# Altium schematic sheet lab1_sokolov_usb_i2c.SchDoc: =title_line_1 + title_line_2
size 594 x 420 mm; SheetNumber: n
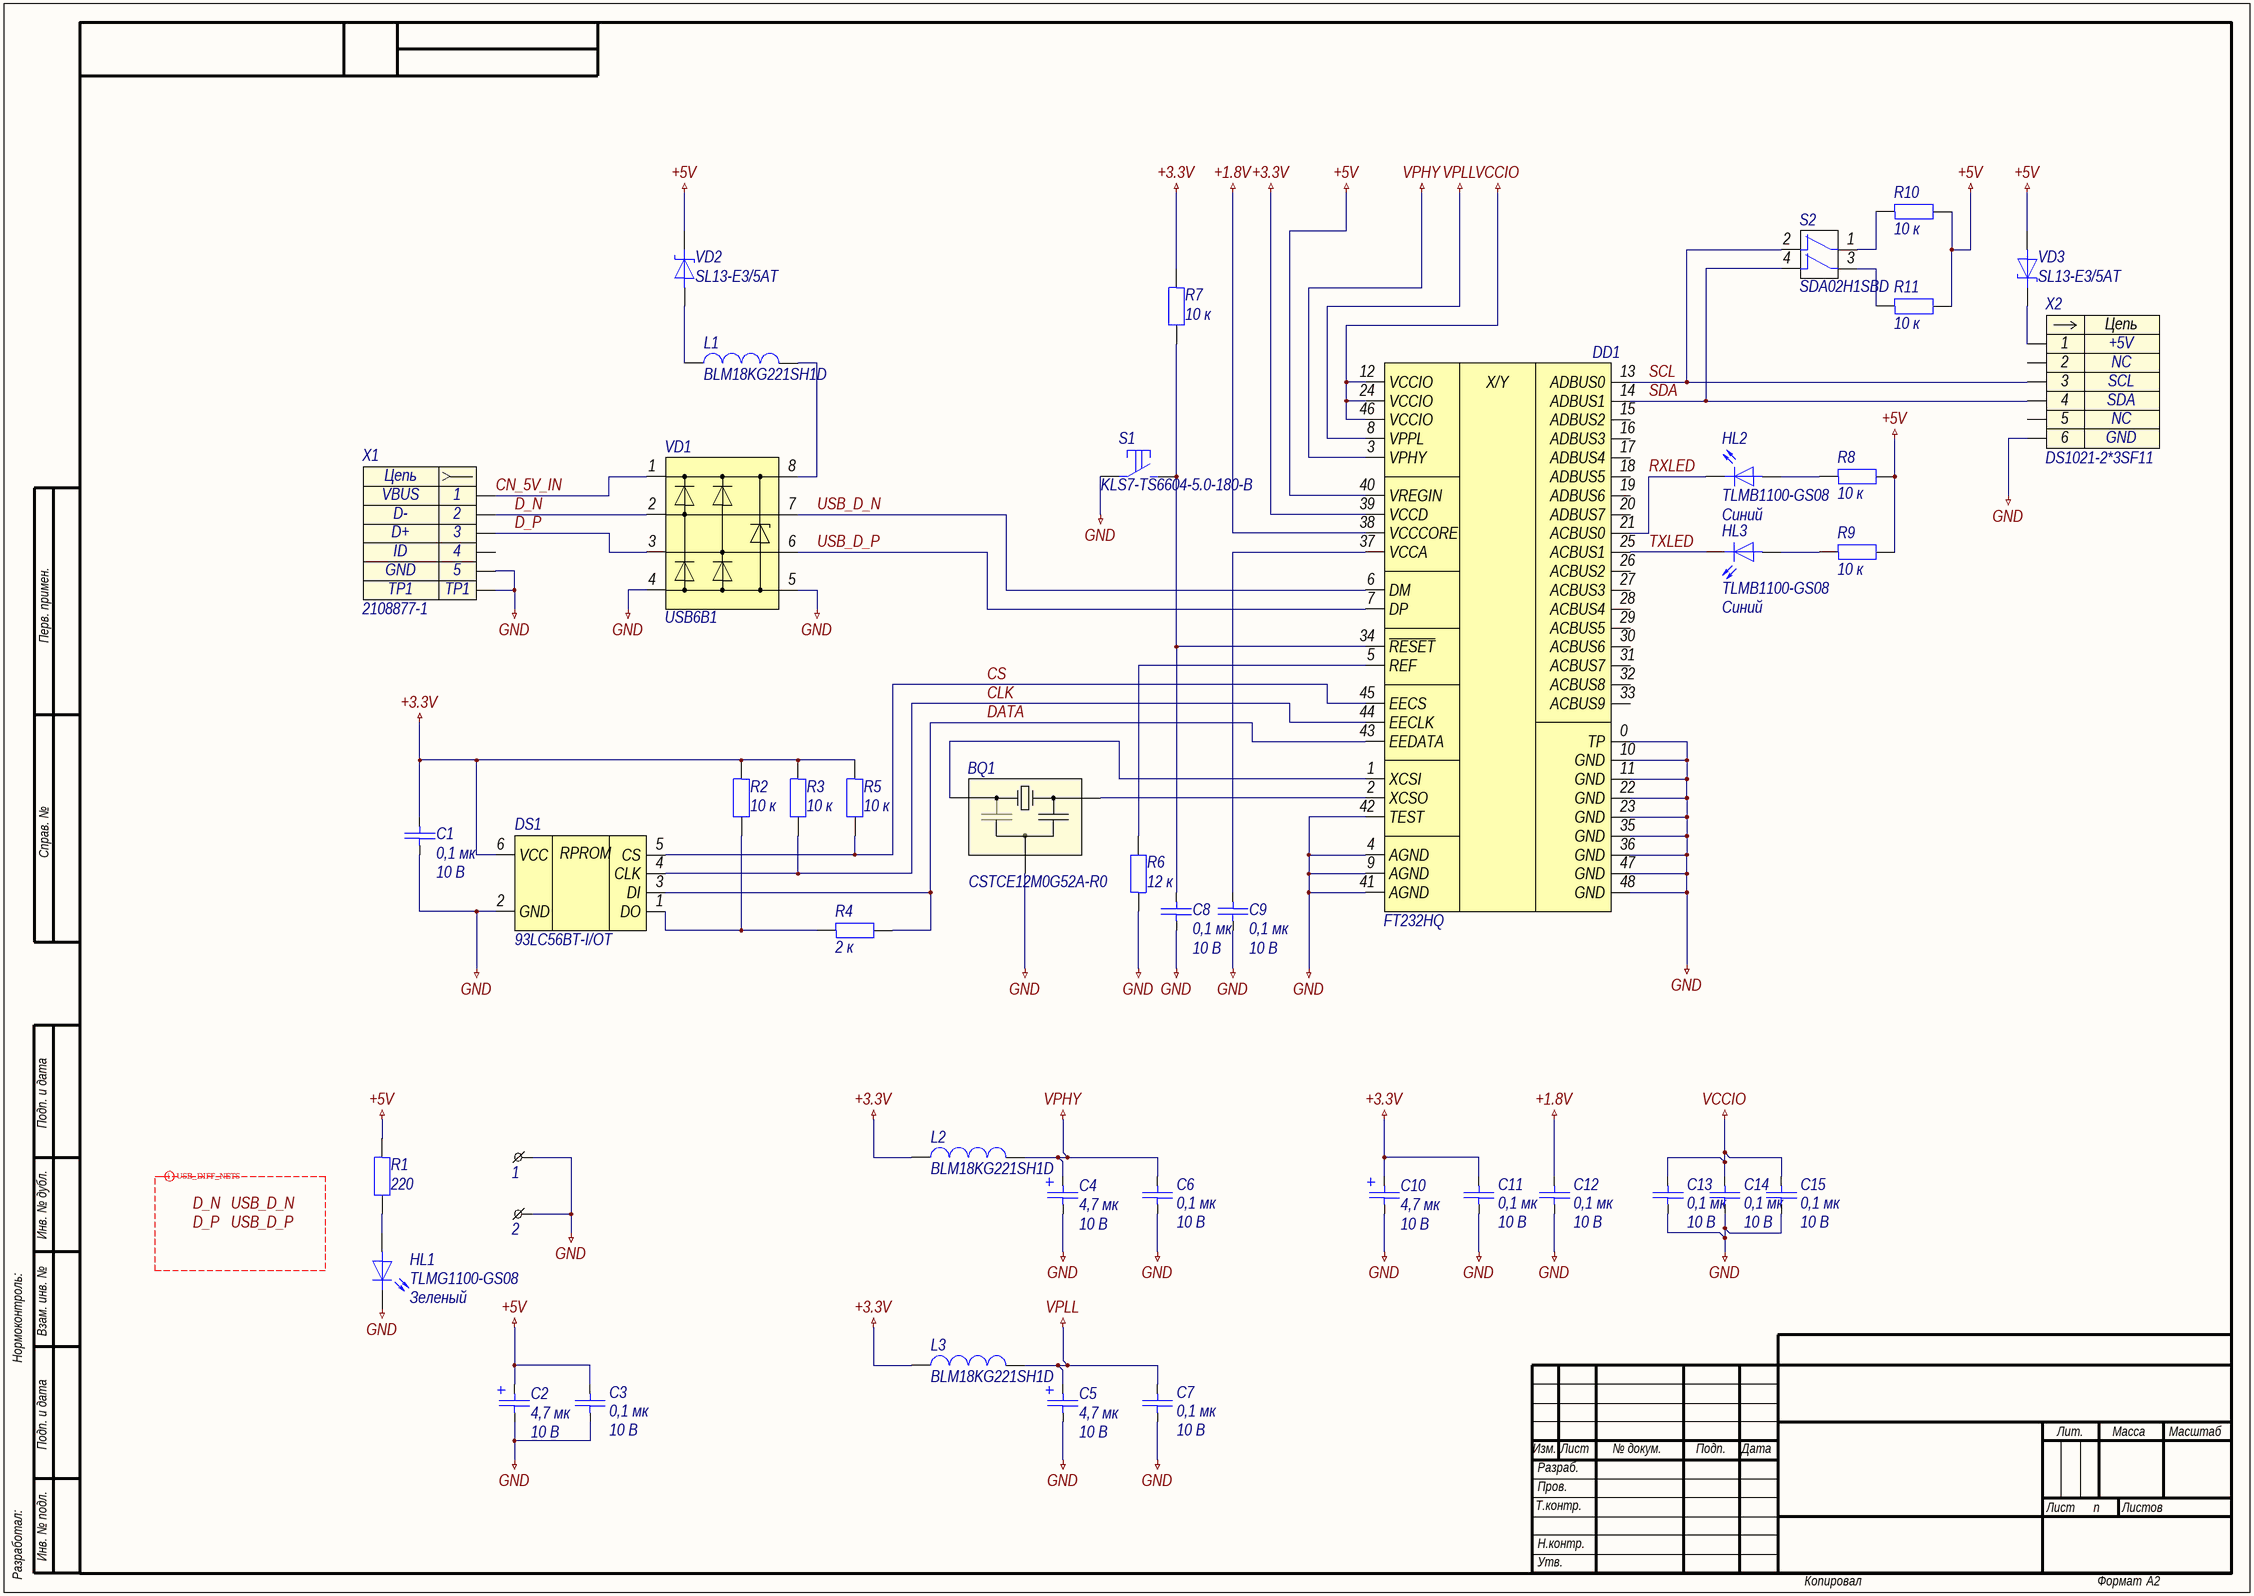
[diagram p0: lab1_sokolov_usb_i2c.SchDoc]

## Parts
1  MOUNTING_HOLE  [HOLE_1,6X3,3]  (value not drawn)
2  MOUNTING_HOLE  [HOLE_1,6X3,3]  (value not drawn)
BQ1  CSTCE12M0G52A-R0  [CSTCE-3-320X130X70]
C1  0,1 мк  Напряжение: 10 В  [C0603]
C2  4,7 мк  Напряжение: 10 В  [C3216-18]
C3  0,1 мк  Напряжение: 10 В  [C0603]
C4  4,7 мк  Напряжение: 10 В  [C3216-18]
C5  4,7 мк  Напряжение: 10 В  [C3216-18]
C6  0,1 мк  Напряжение: 10 В  [C0603]
C7  0,1 мк  Напряжение: 10 В  [C0603]
C8  0,1 мк  Напряжение: 10 В  [C0603]
C9  0,1 мк  Напряжение: 10 В  [C0603]
C10  4,7 мк  Напряжение: 10 В  [C3216-18]
C11  0,1 мк  Напряжение: 10 В  [C0603]
C12  0,1 мк  Напряжение: 10 В  [C0603]
C13  0,1 мк  Напряжение: 10 В  [C0603]
C14  0,1 мк  Напряжение: 10 В  [C0603]
C15  0,1 мк  Напряжение: 10 В  [C0603]
DD1  FT232HQ  [QFN-48-800X800X90]
DS1  93LC56BT-I/OT  [SOT-23-6]
HL1  TLMG1100-GS08  Colour: Зеленый  [HL0603]
HL2  TLMB1100-GS08  Colour: Синий  [HL0603]
HL3  TLMB1100-GS08  Colour: Синий  [HL0603]
L1  BLM18KG221SH1D  [BLM-2-0603]
L2  BLM18KG221SH1D  [BLM-2-0603]
L3  BLM18KG221SH1D  [BLM-2-0603]
R1  220  [R0603]
R2  10 к  [R0603]
R3  10 к  [R0603]
R4  2 к  [R0603]
R5  10 к  [R0603]
R6  12 к  [R0603]
R7  10 к  [R0603]
R8  10 к  [R0603]
R9  10 к  [R0603]
R10  10 к  [R0603]
R11  10 к  [R0603]
S1  KLS7-TS6604-5.0-180-B  [KLS7-TS6604-5.0-180-B]
S2  SDA02H1SBD  [SDA02H1SBD]
VD1  USB6B1  [SO-8]
VD2  SL13-E3/5AT  [DO-214AC]
VD3  SL13-E3/5AT  [DO-214AC]
X1  2108877-1  [2108877-1]
X2  DS1021-2*3SF11  [DS1021-2X3SF11]

## Nets
+1.8V: C12.1 DD1.38(VCCCORE)
+3.3V: C1.1 C10.1 C11.1 DD1.39(VCCD) DS1.6(VCC) L2.1 L3.1 R2.1 R3.1 R5.1 R7.1
+5V: C2.1 C3.1 DD1.40(VREGIN) R1.1 R8.2 R9.2 R10.2 R11.2 VD2.1 VD3.2
GND: 1.1 2.1 BQ1.2 C1.2 C2.2 C3.2 C4.2 C5.2 C6.2 C7.2 C8.2 C9.1 C10.2 C11.2 C12.2 C13.2 C14.2 C15.2 DD1.0(TP) DD1.4(AGND) DD1.9(AGND) DD1.10(GND) DD1.11(GND) DD1.22(GND) DD1.23(GND) DD1.35(GND) DD1.36(GND) DD1.41(AGND) DD1.42(TEST) DD1.47(GND) DD1.48(GND) DS1.2(GND) HL1.1 R6.1 S1.1 VD1.4 VD1.5 X1.5 X1.TP1 X2.6
VCCIO: C13.1 C14.1 C15.1 DD1.12(VCCIO) DD1.24(VCCIO) DD1.46(VCCIO)
VPHY: C4.1 C6.1 DD1.3(VPHY) L2.2
VPLL: C5.1 C7.1 DD1.8(VPPL) L3.2
CLK: DD1.44(EECLK) DS1.4(CLK) R3.2
CN_5V_IN: VD1.1 X1.1
CS: DD1.45(EECS) DS1.5(CS) R5.2
D_N: VD1.2 X1.2
D_P: VD1.3 X1.3
DATA: DD1.43(EEDATA) DS1.3(DI) R4.2
RXLED: DD1.21(ACBUS0) HL2.1
SCL: DD1.13(ADBUS0) S2.2 X2.3
SDA: DD1.14(ADBUS1) S2.4 X2.4
TXLED: DD1.25(ACBUS1) HL3.1
USB_D_N: DD1.6(DM) VD1.7
USB_D_P: DD1.7(DP) VD1.6
NetBQ1_1: BQ1.1 DD1.2(XCSO)
NetBQ1_3: BQ1.3 DD1.1(XCSI)
NetC8_1: C8.1 DD1.34(~{RESET}) R7.2 S1.2
NetC9_2: C9.2 DD1.37(VCCA)
NetDD1_5: DD1.5(REF) R6.2
NetDS1_1: DS1.1(DO) R2.2 R4.1
NetHL1_2: HL1.2 R1.2
NetHL2_2: HL2.2 R8.1
NetHL3_2: HL3.2 R9.1
NetL1_1: L1.1 VD2.2
NetL1_2: L1.2 VD1.8
NetR10_1: R10.1 S2.1
NetR11_1: R11.1 S2.3
NetVD3_1: VD3.1 X2.1

Not connected (* = marked no-connect by the designer): DD1 15(ADBUS2) 16(ADBUS3) 17(ADBUS4) 18(ADBUS5) 19(ADBUS6) 20(ADBUS7) 26(ACBUS2) 27(ACBUS3) 28(ACBUS4) 29(ACBUS5) 30(ACBUS6) 31(ACBUS7) 32(ACBUS8) 33(ACBUS9); X1 4; X2 2 5

## Layout directives
differential pair; rule Differential Pairs Routing [Pref Gap = 0.254mm    Min Gap  = 0.15mm    Max Gap  = 0.254mmPref Width = 0.381mm    Min Width  = 0.155mm    Max Width  = 0.381mm]; differential pair class USB_NETS_CLASS: D_N, D_P, USB_D_N, USB_D_P

## Notes on the sheet
- Labels drawn without touching a wire or pin: D_N, D_P, USB_D_N, USB_D_P
- Перв. примен.
- Справ. №
- Подп. и дата
- Инв. № дубл.
- Нормоконтроль:
- Взам. инв. №
- Изм.
- Лист
- № докум.
- Подп.
- Дата
- Лит.
- Масса
- Масштаб
- Т.контр.
- Пров.
- Разраб.
- Листов
- Разработал:
- Инв. № подл.
- Н.контр.
- Утв.
- Копировал
- Формат
- А2
- (in symbol 2108877-1_micro_usb-b) Цепь
- (in symbol dd0019) X/Y
- (in symbol ds0001) RPROM
- (in symbol x0003) Цепь

## Library data of the parts
1 2 = Отверстие 1,6x3,3: id: fstn0011; Описание: Отверстие под М1,5; Диаметр отверстия: 1,6 мм; Параметры металлизации: 3,3 мм; Наименование: Отверстие 1,6x3,3
BQ1 = bq0001: =Описание; ID: bq0001; Фамилия: Самарин; Описание: Кварцевый резонатор 12 МГц; Производитель: Murata Manufacturing Co., Ltd.; Частота: 12 МГц; Корпус: 3,20 x 1,30 x 0,70; Наименование: CSTCE12M0G52A-R0; HelpURL: https://www.murata.com/en-us/products/productdetail?partno=CSTCE12M0G52A-R0
C1 C3 C6-C9 C11-C15 = c0054: =Описание; ID: c0054; Фамилия: Паньков; Описание: Конденсатор керамический чип 0603 100 нФ 10 В ±10 %; Наименование: CC0603KRX7R6BB104; Производитель: YAGEO Corp.; Отклонение: ±10 %; Рабочие температуры: от –55 °С до +125 °С; Температурный коэффициент емкости: X7R; Корпус: 0603; Номинал: 0,1 мк; Номинальное напряжение: 10 В; HelpURL: https://www.yageo.com/upload/media/product/productsearch/datasheet/mlcc/UPY-GPHC_X7R_6.3V-to-50V_20.pdf
C2 C4 C5 C10 = c0044: =Описание; ID: c0044; Фамилия: Паньков; Описание: Конденсатор танталовый чип 3216-18 4,7 мкФ 10 В ±10 %; Наименование: 293D475X9010A2TE3; Производитель: Vishay Intertechnology, Inc.; Отклонение: ±10 %; Эквивалентное последовательное сопротивление: 5,0 Ом; Среднеквадратичный размах пульсации тока: 0,12 А; Рабочие температуры: от –55 °С до +125 °С; Корпус: 3216-18; Номинал: 4,7 мк; Номинальное напряжение: 10 В; HelpURL: https://www.vishay.com/capacitors/list/product-40002/
DD1 = dd0019: =Описание; ID: dd0019; Фамилия: Соколов; Описание: Преобразователь USB-I2C; Производитель: FTDI Limited; Корпус: QFN-48; Наименование: FT232HQ; HelpURL: https://ftdichip.com/products/ft232hq/
DS1 = ds0001: =Описание; ID: ds0001; Фамилия: Соколов; Описание: EEPROM 2 Кб 3 линии; Производитель: Microchip Technology Inc.; Наименование: 93LC56BT-I/OT; Корпус: SOT-23-6; HelpURL: https://www.microchip.com/wwwproducts/en/93LC56B
HL1 = hl0005: =Описание; ID: hl0005; Фамилия: Ларионов; Описание: Светодиод чип 0603 зеленый; Производитель: Vishay Intertechnology, Inc.; Номинальная сила света: 35 мкд; Номинальная длина волны: 570 нм; Номинальный прямой ток: 30 мА; Номинальное падение напряжения: 2,1 В; Рассеиваемая мощность: 90 мВт; Рабочие температуры: от –40 °С до +100 °С; Корпус: 0603; Наименование: TLMG1100-GS08; Цвет: Зеленый; HelpURL: https://www.vishay.com/leds/list/product-83173/
HL2 HL3 = hl0006: =Описание; ID: hl0006; Фамилия: Ларионов; Описание: Светодиод чип 0603 синий; Производитель: Vishay Intertechnology, Inc.; Номинальная сила света: 5 мкд; Номинальная длина волны: 466 нм; Номинальный прямой ток: 30 мА; Номинальное падение напряжения: 3,9 В; Рассеиваемая мощность: 90 мВт; Рабочие температуры: от –40 °С до +100 °С; Корпус: 0603; Примечание: Not for new design; Наименование: TLMB1100-GS08; Цвет: Синий; HelpURL: https://www.vishay.com/leds/list/product-83173/
L1-L3 = l0001: =Описание; ID: l0001; Фамилия: Ларионов; Описание: Ферритовая бусина 220 Ом ±25 %; Производитель: Murata Manufacturing Co., Ltd.; Сопротивление, 100 МГц: 220 Ом; Отклонение, 100 МГц: ±25 %; Сопротивление при постоянном токе: 0,05 Ом; Рабочие температуры: от –55 °С до +125 °С; Корпус: 0603; Наименование: BLM18KG221SH1D; HelpURL: https://www.murata.com/en-global/products/productdetail?partno=BLM18KG221SH1%23
R1 = r0008: =Описание; ID: r0008; Фамилия: Ларионов; Описание: Резистор чип 0603 220 Ом ±1 % 0,1 Вт; Наименование: RC0603FR-07220RL; Производитель: Yageo; Отклонение: ±1 %; Номинальное напряжение: 75 В; Рабочие температуры: от -55 °С до +155 °С; Номинальный ток: 1 А; Корпус: 0603; Номинал: 220; HelpURL: https://www.yageo.com/upload/media/product/productsearch/datasheet/rchip/PYu-RC_Group_51_RoHS_L_11.pdf
R2 R3 R5 = r0011: =Описание; ID: r0011; Фамилия: Самарин; Описание: Резистор чип 0603 10 кОм ±1 % 0,1 Вт; Наименование: RC0603FR-0710KL; Производитель: Yageo; Отклонение: ±1 %; Номинальное напряжение: 75 В; Рабочие температуры: от -55 °С до +155 °С; Номинальный ток: 1 А; Корпус: 0603; Номинал: 10 к; HelpURL: https://www.yageo.com/upload/media/product/productsearch/datasheet/rchip/PYu-RC_Group_51_RoHS_L_11.pdf
R4 = r0013: =Описание; ID: r0013; Фамилия: Соколов; Описание: Резистор чип 0603 2 кОм ±1 % 0,1 Вт; Наименование: RS73G1JTTD2001F; Производитель: KOA Speer; Отклонение: ±1 %; Номинальное напряжение: 100 В; Рабочие температуры: от -55 °С до +155 °С; Номинальный ток: 1 А; Корпус: 0603; Номинал: 2 к; HelpURL: https://ru.mouser.com/datasheet/2/219/RS73-1759534.pdf
R6 = r0064: =Описание; ID: r0064; Фамилия: Соколов; Описание: Резистор чип 0603 12 кОм ±1 % 0,1 Вт; Наименование: AC0603FR-1012KL; Производитель: YAGEO Corp.; Отклонение: ±1 %; Номинальное напряжение: 75 В; Номинальный ток: 1 А; Рабочие температуры: от –55 °С до +155 °С; Корпус: 0603; Примечание: Ряд E24; Номинал: 12 к; HelpURL: https://www.yageo.com/upload/media/product/productsearch/datasheet/rchip/PYu-AC_51_RoHS_L_7.pdf
R7-R11 = r0012: =Описание; ID: r0012; Фамилия: Самарин; Описание: Резистор чип 0603 10 кОм ±1 % 0,1 Вт; Наименование: RC0603FR-0710KL; Производитель: Yageo; Отклонение: ±1 %; Номинальное напряжение: 75 В; Рабочие температуры: от -55 °С до +155 °С; Номинальный ток: 1 А; Корпус: 0603; Номинал: 10 к; HelpURL: https://www.yageo.com/upload/media/product/productsearch/datasheet/rchip/PYu-RC_Group_51_RoHS_L_11.pdf
S1 = s0002: =Описание; ID: s0002; Фамилия: Паньков; Описание: Тактовая кнопка поверхностного монтажа; Производитель: Ningbo KLS Electronic Co., Ltd.; Ток нагрузки: 50 мА @ 12 В; Сопротивление контакта: 50 мОм; Количество контактов: 4; Рабочие температуры: от –20 °С до +70 °С; Промывка: Запрещена; Корпус: 6,00 x 6,00 x 5,00; Наименование: KLS7-TS6604-5.0-180-B; HelpURL: http://www.klsele.com/products/Switches/Tact-Switches-Series/939.html
S2 = s0006: =Описание; ID: s0006; Фамилия: Козлов; Описание: 2-х позиционный движковый переключатель; Производитель: C&K; Ток нагрузки: 100 мА @ 5 В; Сопротивление контакта: 50 мОм; Количество контактов: 4; Рабочие температуры: от –40 °С до +85 °С; Промывка: Запрещена; Корпус: 7,06 х 9,30 х 5,45; Наименование: SDA02H1SBD; HelpURL: https://www.ckswitches.com/products/switches/product-details/DIP/SDA/SDA02H1SBD/
VD1 = vd0005: =Описание; ID: vd0005; Фамилия: Ларионов; Описание: Диодная сборка для подавления помех, от 6 В; Производитель: STMicroelectronics; Наименование: USB6B1; Корпус: SO-8; HelpURL: https://www.st.com/content/st_com/en/products/protection-devices/esd-protection/usb-port-protection/usb6b1.html
VD2 VD3 = vd0003: =Описание; ID: vd0003; Фамилия: Ларионов; Описание: Диод Шоттки 30 В 1,5 А; Производитель: Vishay Intertechnology, Inc.; Максимальное прямое напряжение: 0,445 В; Максимальное обратное напряжение: 30 В; Максимальный прямой ток: 1,5 А; Рабочие температуры: от –55 °С до +125 °С; Наименование: SL13-E3/5AT; Корпус: DO-214AC; HelpURL: https://www.vishay.com/product?docid=88740
X1 = 2108877-1_micro_usb-b: Contact_1: VBUS; Contact_2: D-; Contact_3: D+; Contact_4: ID; Contact_5: GND; Наименование: 2108877-1
X2 = x0003: =Описание; Contact_1: +5V; Contact_2: NC; Contact_3: SCL; Contact_4: SDA; Contact_6: GND; ID: x0003; Фамилия: Самарин; Описание: PLS 3x2 pin 2,54 мм вилка прямой; Производитель: Connfly Electronic Co. LTD; Contact_5: NC; Наименование: DS1021-2*3SF11; HelpURL: http://www.connfly.com/productshow.aspx?id=118